# Altium schematic sheet MCU&VoltageRegulator.SchDoc
size A4; SheetNumber: 1; SheetTotal: 7; DocumentName: Top level with MCU and V-Reg
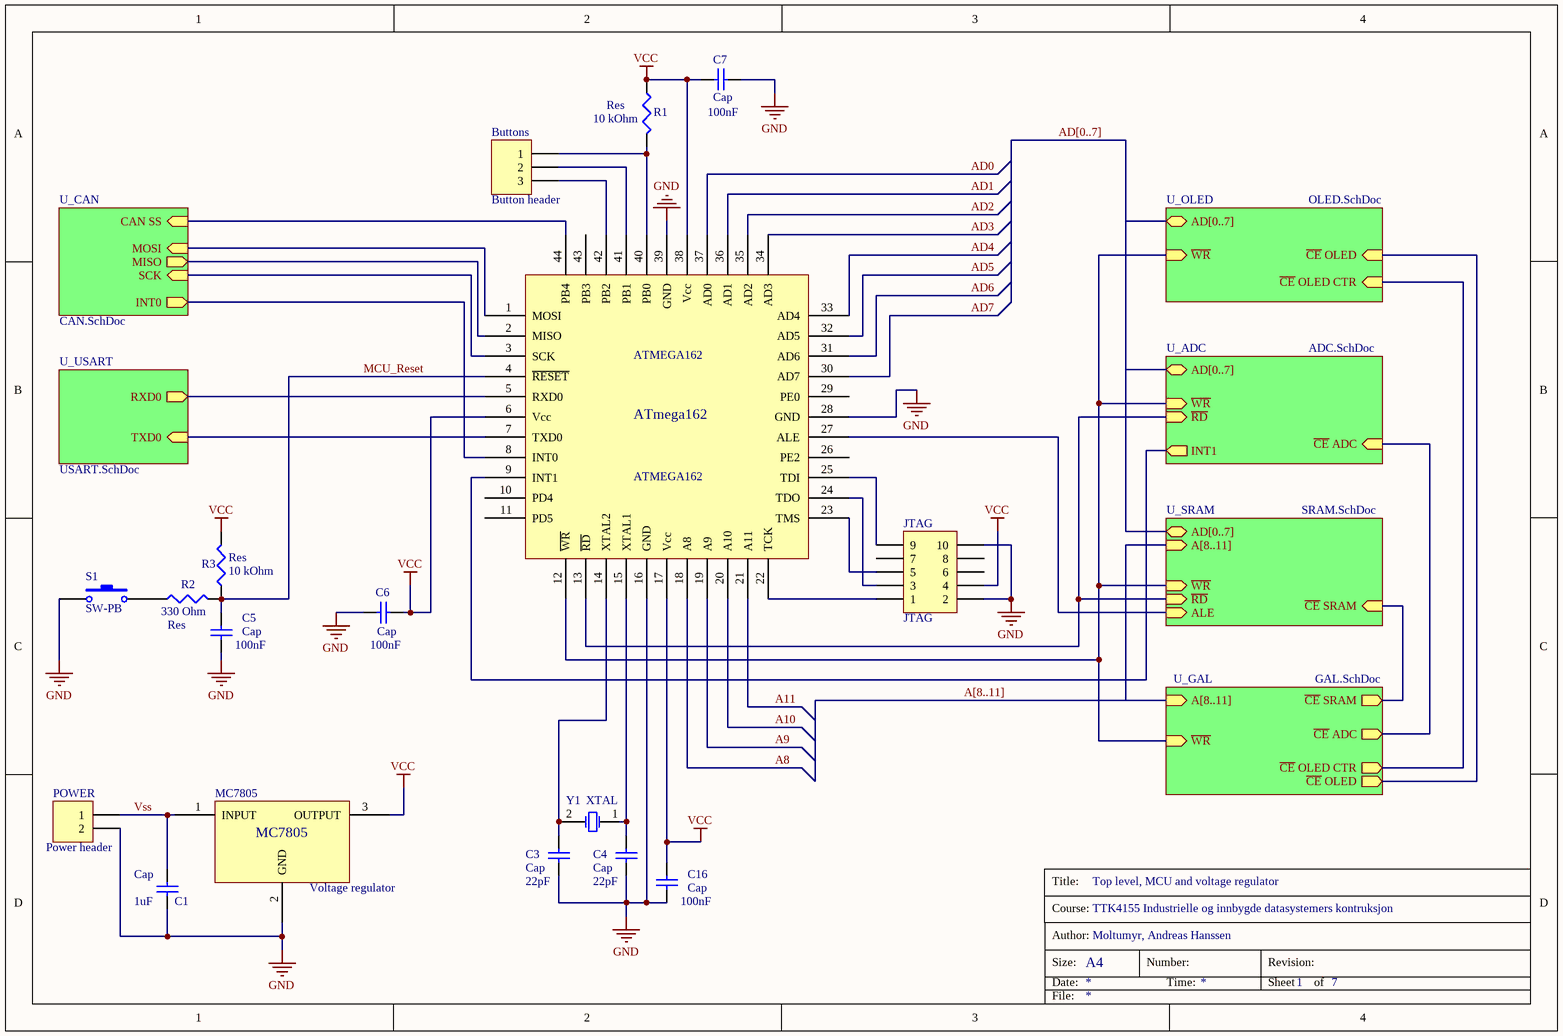
[diagram p0: MCU&VoltageRegulator.SchDoc]

## Parts
ATMEGA162  ATMEGA162  [ATmega162 TQFP 44-pin]
Buttons  Button header  [HDR1X3]
C1  Cap  value 1uF  [C1210]
C3  Cap  value 22pF  [C1210]
C4  Cap  value 22pF  [C1210]
C5  Cap  value 100nF  [C1210]
C6  Cap  value 100nF  [C1210]
C7  Cap  value 100nF  [C1210]
C16  Cap  value 100nF  [C1210]
JTAG  JTAG  [HDR2X5]
MC7805  Voltage regulator  [MC7805 DPAK 3-PIN]
POWER  Power header  [HDR1X2]
R1  Res  value 10 kOhm  [14-1210]
R2  Res  value 330 Ohm  [14-1210]
R3  Res  value 10 kOhm  [14-1210]
S1  SW-PB  [SPST-2]
Y1  XTAL  [R38]

## Sub-sheets
U_ADC = ADC.SchDoc: ~{CE} ADC (in), AD[0..7] (bidir), ~{WR} (in), ~{RD} (in), INT1 (out)
U_CAN = CAN.SchDoc: CAN SS (in), MOSI (in), MISO (out), INT0 (out), SCK (in)
U_GAL = GAL.SchDoc: A[8..11] (in), ~{CE} SRAM (out), ~{CE} OLED (out), ~{CE} OLED CTR (out), ~{CE} ADC (out), ~{WR} (in)
U_OLED = OLED.SchDoc: ~{CE} OLED (in), ~{CE} OLED CTR (in), AD[0..7] (bidir), ~{WR} (in)
U_SRAM = SRAM.SchDoc: AD[0..7] (bidir), ALE (in), ~{WR} (in), A[8..11] (in), ~{RD} (in), ~{CE} SRAM (in)
U_USART = USART.SchDoc: TXD0 (in), RXD0 (out)

## Nets
GND: ATMEGA162.16(GND) ATMEGA162.28(GND) ATMEGA162.39(GND) C1.1 C3.2 C4.1 C5.1 C6.2 C7.2 C16.2 JTAG.2 JTAG.10 MC7805.2(GND) POWER.2 S1.1
VCC: ATMEGA162.6(Vcc) ATMEGA162.17(Vcc) ATMEGA162.38(Vcc) C6.1 C7.1 C16.1 JTAG.4 MC7805.3(OUTPUT) R1.1 R3.2
A8: ATMEGA162.18(A8)
A9: ATMEGA162.19(A9)
A10: ATMEGA162.20(A10)
A11: ATMEGA162.21(A11)
AD0: ATMEGA162.37(AD0)
AD1: ATMEGA162.36(AD1)
AD2: ATMEGA162.35(AD2)
AD3: ATMEGA162.34(AD3)
AD4: ATMEGA162.33(AD4)
AD5: ATMEGA162.32(AD5)
AD6: ATMEGA162.31(AD6)
AD7: ATMEGA162.30(AD7)
MCU_Reset: ATMEGA162.4(~{RESET}) C5.2 R2.2 R3.1
Vss: C1.2 MC7805.1(INPUT) POWER.1
NetATMEGA162_1: ATMEGA162.1(MOSI) ; sheet U_CAN/MOSI
NetATMEGA162_2: ATMEGA162.2(MISO) ; sheet U_CAN/MISO
NetATMEGA162_3: ATMEGA162.3(SCK) ; sheet U_CAN/SCK
NetATMEGA162_5: ATMEGA162.5(RXD0) ; sheet U_USART/RXD0
NetATMEGA162_7: ATMEGA162.7(TXD0) ; sheet U_USART/TXD0
NetATMEGA162_8: ATMEGA162.8(INT0) ; sheet U_CAN/INT0
NetATMEGA162_9: ATMEGA162.9(INT1) ; sheet U_ADC/INT1
NetATMEGA162_12: ATMEGA162.12(~{WR}) ; sheet U_GAL/~{WR}, sheet U_SRAM/~{WR}, sheet U_ADC/~{WR}, sheet U_OLED/~{WR}
NetATMEGA162_13: ATMEGA162.13(~{RD}) ; sheet U_SRAM/~{RD}, sheet U_ADC/~{RD}
NetATMEGA162_14: ATMEGA162.14(XTAL2) C3.1 Y1.2(OSC2)
NetATMEGA162_15: ATMEGA162.15(XTAL1) C4.2 Y1.1(OSC1)
NetATMEGA162_22: ATMEGA162.22(TCK) JTAG.1
NetATMEGA162_23: ATMEGA162.23(TMS) JTAG.5
NetATMEGA162_24: ATMEGA162.24(TDO) JTAG.3
NetATMEGA162_25: ATMEGA162.25(TDI) JTAG.9
NetATMEGA162_27: ATMEGA162.27(ALE) ; sheet U_SRAM/ALE
NetATMEGA162_40: ATMEGA162.40(PB0) Buttons.1 R1.2
NetATMEGA162_41: ATMEGA162.41(PB1) Buttons.2
NetATMEGA162_42: ATMEGA162.42(PB2) Buttons.3
NetATMEGA162_44: ATMEGA162.44(PB4) ; sheet U_CAN/CAN SS
NetR2_1: R2.1 S1.2
(unnamed): sheet U_GAL/~{CE} SRAM, sheet U_SRAM/~{CE} SRAM
(unnamed): sheet U_GAL/~{CE} OLED, sheet U_OLED/~{CE} OLED
(unnamed): sheet U_GAL/~{CE} OLED CTR, sheet U_OLED/~{CE} OLED CTR
(unnamed): sheet U_GAL/~{CE} ADC, sheet U_ADC/~{CE} ADC

Not connected (* = marked no-connect by the designer): ATMEGA162 10(PD4) 11(PD5) 26(PE2) 29(PE0) 43(PB3); JTAG 6 7 8

## Buses and harness runs
bus A[8..11] = sheet U_GAL/A[8..11] = sheet U_SRAM/A[8..11]
bus AD[0..7] = sheet U_ADC/AD[0..7] = sheet U_OLED/AD[0..7] = sheet U_SRAM/AD[0..7]

## Notes on the sheet
- Top level, MCU and voltage regulator
- Title:
- Course:
- TTK4155 Industrielle og innbygde datasystemers kontruksjon
- Size:
- Date:
- Author:
- A4
- Moltumyr, Andreas Hanssen
- Number:
- Time:
- Revision:
- Sheet
- of
- File:
- (in symbol ATMEGA162) ATmega162

## Library data of the parts
ATMEGA162 = ATMEGA162: Atmega162 MicroControllerUnit
Buttons = Header 3: Header, 3-Pin; LatestRevisionDate: 17-Jul-2002; LatestRevisionNote: Re-released for DXP Platform.; Publisher: Altium Limited
C1 C3-C7 C16 = Cap Semi: Capacitor (Semiconductor SIM Model); Published: 8-Jun-2000; LatestRevisionDate: 29-May-2009; LatestRevisionNote: IPC-7351 Footprint Added.; PackageReference: C1206; Publisher: Altium Limited; PackageDescription: Chip Capacitor
JTAG = Header 5X2: Header, 5-Pin, Dual row; LatestRevisionDate: 17-Jul-2002; LatestRevisionNote: Re-released for DXP Platform.; Publisher: Altium Limited
MC7805 = MC7805: MC7805 Voltage Regulator
POWER = Header 2: Header, 2-Pin; LatestRevisionDate: 17-Jul-2002; LatestRevisionNote: Re-released for DXP Platform.; Publisher: Altium Limited
R1-R3 = Res3: Resistor; Published: 8-Jun-2000; LatestRevisionDate: 29-May-2009; LatestRevisionNote: IPC-7351 Footprint Added.; PackageReference: J1-0603; Publisher: Altium Limited; PackageDescription: Chip Resistor
S1 = SW-PB: Switch; Published: 24-Mar-1999; LatestRevisionDate: 17-Jul-2002; LatestRevisionNote: Re-released for DXP Platform.; PackageReference: SPST-2; Publisher: Altium Limited; PackageDescription: Switch; 2 Leads
Y1 = XTAL: Crystal Oscillator; Published: 8-Jun-2000; LatestRevisionDate: 17-Jul-2002; LatestRevisionNote: Re-released for DXP Platform.; PackageReference: R38; Publisher: Altium Limited; PackageDescription: Crystal, Thru-Hole; 2 Leads; Body 3.1 x 8.2 mm (Dia.xH)